# Altium schematic sheet BalEv_Mechanic_v1_0.SchDoc
size A4; SheetNumber: 9; SheetTotal: 9
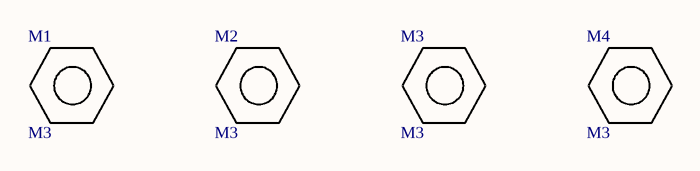
[diagram p0: BalEv_Mechanic_v1_0.SchDoc]

## Parts
M1  M3  [Nut M3 Unconnected]
M2  M3  [Nut M3 Unconnected]
M3  M3  [Nut M3 Unconnected]
M4  M3  [Nut M3 Unconnected]

## Notes on the sheet
- Date :
- Revision :
- Sheet
- of
- Design by :

## Library data of the parts
M1-M4 = Nut Unconnected: Value: M3